# Altium schematic sheet H-00488 - Connectors.SchDoc: Rear Side Connectors
size 403 x 281 mm; DocumentNumber: 10; SheetNumber: 10; SheetTotal: 12
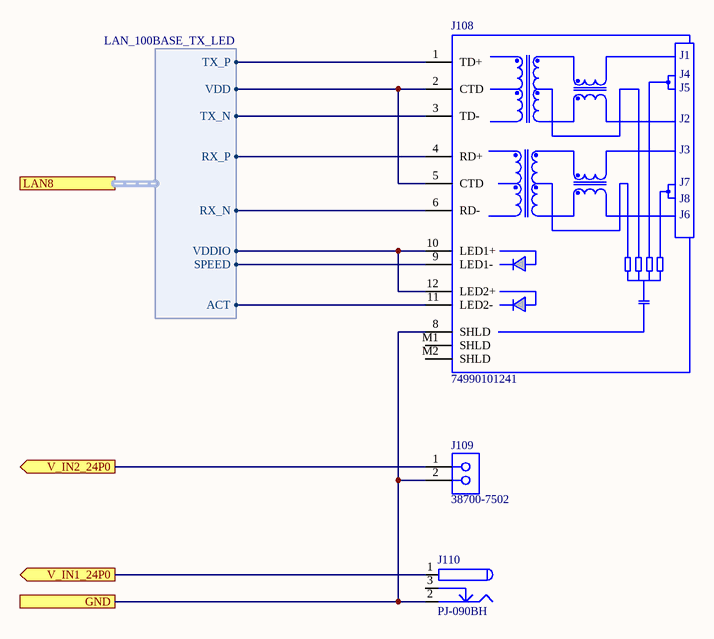
[diagram p0: H-00488 - Connectors.SchDoc]

## Parts
J108  74990101241  [WURTH_74990101241]
J109  38700-7502  [MOLEX_387007502]
J110  PJ-090BH  [CUI_PJ-090BH]

## Ports
GND, LAN8 (harness LAN_100BASE_TX_LED), V_IN1_24P0 (out), V_IN2_24P0 (out)

## Harnesses
LAN_100BASE_TX_LED: RX_N, RX_P, TX_P, TX_N, ACT, SPEED, VDDIO, VDD

## Nets
GND: J108.8(SHLD) J109.2 J110.2 ; port GND
V_IN1_24P0: J110.1 ; port V_IN1_24P0
V_IN2_24P0: J109.1 ; port V_IN2_24P0
NetJ108_1: J108.1(TD+) ; port LAN8.TX_P
NetJ108_2: J108.2(CTD) J108.5(CTD) ; port LAN8.VDD
NetJ108_3: J108.3(TD-) ; port LAN8.TX_N
NetJ108_4: J108.4(RD+) ; port LAN8.RX_P
NetJ108_6: J108.6(RD-) ; port LAN8.RX_N
NetJ108_9: J108.9(LED1-) ; port LAN8.SPEED
NetJ108_10: J108.10(LED1+) J108.12(LED2+) ; port LAN8.VDDIO
NetJ108_11: J108.11(LED2-) ; port LAN8.ACT

Not connected (* = marked no-connect by the designer): J108 M1(SHLD) M2(SHLD); J110 3

## Notes on the sheet
- PROJECT
- DESCRIPTION
- SIZE
- ENGINEER
- VARIANT
- A3
- TITLE
- MODIFIED
- RELEASE
- HIBER BV
  MOERMANSKKADE 600
  1013 BC, AMSTERDAM
  THE NETHERLANDS
- FILE NAME
- APPROVER
- SHEET
- APPROVED
- OF
- THIS DOCUMENT AND THE DATA DISCLOSED HEREIN OR HEREWITH IS THE PROPERTY OF HIBER INTERNATIONAL BV. IT CONTAINS CONFIDENTIAL AND PROPRIETARY INFORMATION THAT CANNOT BE REPRODUCED OR DIVULGED, IN WHOLE OR IN PART, WITHOUT WRITTEN AUTHORIZATION.
- (in symbol CMP-01134-4) J1; J4; J5; J2; J3; J7; J8; J6

## Library data of the parts
J108 = CMP-01134-4: Datacom Transformer; Mount: TH; RoHS: Yes; Transformer Type: DATACOM TRANSFORMER; Terminal Finish: Tin; JESD-609 Code: e3
J109 = CMP-01125-1: Barrier Strip Terminal Block, 1 Row(s), 1 Deck(s); Number of Ways: 2; Number of Decks: 1; Safety Approval: UL,CSA; Fastening Method: SCREW; Terminal and Terminal Block Type: BARRIER STRIP TERMINAL BLOCK; Mount: Board; Number of Rows: 1; RoHS: Yes
J110 = CMP-01102-2: Circular DC Power Connector; Mount: TH; RoHS: Yes